# Altium schematic sheet Sheet1.SchDoc
size A
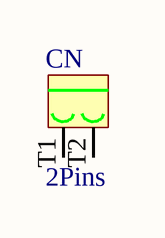
[diagram p0: Sheet1.SchDoc]

## Parts
CN  2Pins  [2Pins_terminal blocks_H]

## Nets

Not connected (* = marked no-connect by the designer): CN T1 T2

## Library data of the parts
CN = 2Pins_pluggable terminal blocks